# EAGLE design FloatWatch-One (EAGLE 7.7.0)
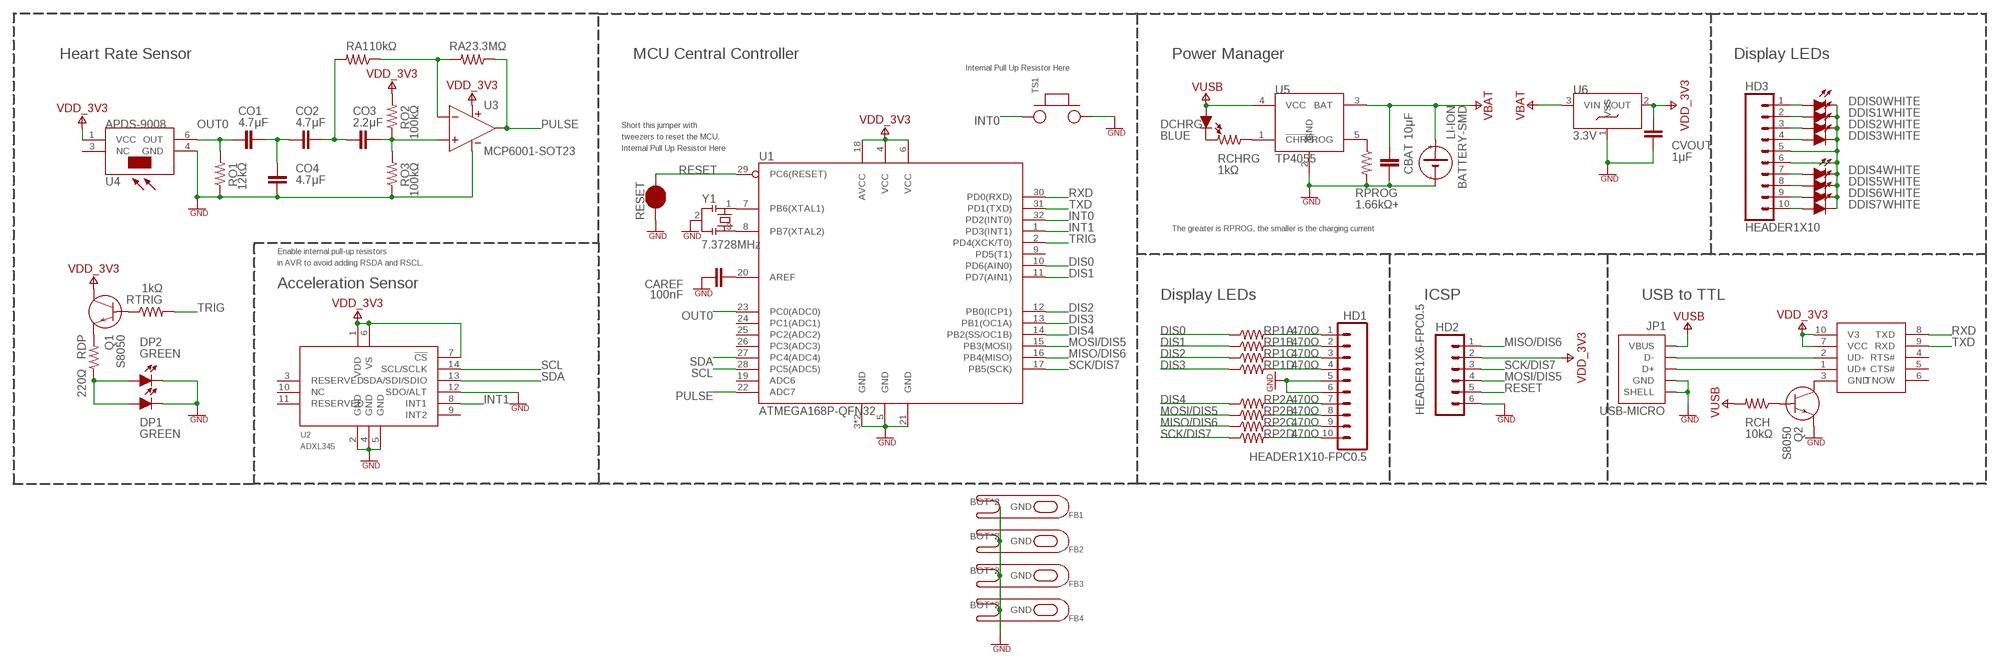
[diagram p0: schematic, sheet 1]

## Parts
CAREF  100nF  CAP-0603  [SMD0603]
CBAT  10μF  CAP-0603  [SMD0603]
CO1  4.7μF  CAP-0603  [SMD0603]
CO2  4.7μF  CAP-0603  [SMD0603]
CO3  2.2μF  CAP-0603  [SMD0603]
CO4  4.7μF  CAP-0603  [SMD0603]
CVOUT  1μF  CAP-0603  [SMD0603]
DCHRG  BLUE  LED-0603  [LED-0603]
DDIS0  WHITE  LED-0603  [LED-0603]
DDIS1  WHITE  LED-0603  [LED-0603]
DDIS2  WHITE  LED-0603  [LED-0603]
DDIS3  WHITE  LED-0603  [LED-0603]
DDIS4  WHITE  LED-0603  [LED-0603]
DDIS5  WHITE  LED-0603  [LED-0603]
DDIS6  WHITE  LED-0603  [LED-0603]
DDIS7  WHITE  LED-0603  [LED-0603]
DP1  GREEN  LED-1206  [LED-1206]
DP2  GREEN  LED-1206  [LED-1206]
FB1  BROAD-STICK  [BOARD-STICK]
FB2  BROAD-STICK  [BOARD-STICK]
FB3  BROAD-STICK  [BOARD-STICK]
FB4  BROAD-STICK  [BOARD-STICK]
HD1  HEADER1X10-FPC0.5  [FPC0.5-10]
HD2  HEADER1X6-FPC0.5  [FPC0.5-6]
HD3  HEADER1X10  [FPC0.5-10-SOLDER]
JP1  USB-MICRO  [USB-MICRO]
LI-ION  BATTERY-SMD  [BAT-SMD]
Q1  S8050  NPN-0  [SOT23-0]
Q2  S8050  NPN-0  [SOT23-0]
RA1  10kΩ  RES-0603  [SMD0603]
RA2  3.3MΩ  RES-0603  [SMD0603]
RCH  10kΩ  RES-0603  [SMD0603]
RCHRG  1kΩ  RES-0603  [SMD0603]
RDP  220Ω  RES-0603  [SMD0603]
RESET  JUMPER-SMD  [JMPER-SMD]
RO1  12kΩ  RES-0603  [SMD0603]
RO2  100kΩ  RES-0603  [SMD0603]
RO3  100kΩ  RES-0603  [SMD0603]
RP1  470Ω  RP-0603  [RP0603]
RP2  470Ω  RP-0603  [RP0603]
RPROG  1.66kΩ+  RES-0603  [SMD0603]
RTRIG  1kΩ  RES-0603  [SMD0603]
TS1  TS-P  [TS-3X4P]
U1  ATMEGA168P-QFN32  [QFN32]
U2  ADXL345  [LGA14]
U3  MCP6001-SOT23  [SOT23-5]
U4  APDS-9008  [APDS-9008]
U5  TP4055  [SOT23-5]
U6  3.3V  XC6206-0  [SOT23-0]
U7  CH340E  [MSOP10]
Y1  7.3728MHz  CSTCE  [CSTCE]

## Nets
!CHRG: RCHRG.1 U5.1(!CHRG)
!GND: DDIS0.C DDIS1.C DDIS2.C DDIS3.C DDIS4.C DDIS5.C DDIS6.C DDIS7.C HD3.5 HD3.6
AREF: CAREF.2 U1.20(AREF)
DIS0: RP1.1 U1.10(PD6(AIN0))
DIS1: RP1.3 U1.11(PD7(AIN1))
DIS2: RP1.5 U1.12(PB0(ICP1))
DIS3: RP1.7 U1.13(PB1(OC1A))
DIS4: RP2.1 U1.14(PB2(SS/OC1B))
DRCHRG: DCHRG.C RCHRG.2
GND: CAREF.1 CBAT.2 CO4.2 CVOUT.2 DP1.C DP2.C FB1.BOT(GND) FB1.TOP(GND) FB2.BOT(GND) FB2.TOP(GND) FB3.BOT(GND) FB3.TOP(GND) FB4.BOT(GND) FB4.TOP(GND) HD1.5 HD1.6 HD2.6 JP1.5(GND) JP1.P1(SHELL) JP1.P2(SHELL) JP1.P3(SHELL) JP1.P4(SHELL) LI-ION.- Q2.2(E) RESET.1 RO1.1 RO3.1 RPROG.2 TS1.2 U1.3(GND) U1.5(GND) U1.21(GND) U1.EP(GND) U2.2(GND) U2.4(GND) U2.5(GND) U2.12(SDO/ALT) U3.2(VSS) U4.4(GND) U5.2(GND) U6.1(VSS) Y1.2
GND(CH340E): Q2.3(C) U7.3(GND)
HD0: DDIS0.A HD3.1
HD1: DDIS1.A HD3.2
HD2: DDIS2.A HD3.3
HD3: DDIS3.A HD3.4
HD4: DDIS4.A HD3.7
HD5: DDIS5.A HD3.8
HD6: DDIS6.A HD3.9
HD7: DDIS7.A HD3.10
INT0: TS1.1 U1.32(PD2(INT0))
INT1: U1.1(PD3(INT1)) U2.8(INT1)
MISO/DIS6: HD2.1 RP2.5 U1.16(PB4(MISO))
MOSI/DIS5: HD2.4 RP2.3 U1.15(PB3(MOSI))
N-IN: RA1.1 RA2.2 U3.4(IN-)
OUT0: CO1.2 RO1.2 U1.23(PC0(ADC0)) U4.6(OUT)
OUT1: CO1.1 CO2.2 CO4.1
OUT2: CO2.1 CO3.2 RA1.2
P-IN: CO3.1 RO2.1 RO3.2 U3.3(IN+)
PROG: RPROG.1 U5.5(PROG)
PULSE: RA2.1 U1.22(ADC7) U3.1(OUT)
QRP: Q1.2(E) RDP.2
RDP: DP1.A DP2.A RDP.1
RESET: HD2.5 RESET.2 U1.29(PC6(RESET))
RH0: HD1.1 RP1.2
RH1: HD1.2 RP1.4
RH2: HD1.3 RP1.6
RH3: HD1.4 RP1.8
RH4: HD1.7 RP2.2
RH5: HD1.8 RP2.4
RH6: HD1.9 RP2.6
RH7: HD1.10 RP2.8
RQTRIG: Q1.1(B) RTRIG.1
RXD: U1.30(PD0(RXD)) U7.8(TXD)
SCK/DIS7: HD2.3 RP2.7 U1.17(PB5(SCK))
SCL: U1.28(PC5(ADC5)) U2.14(SCL/SCLK)
SDA: U1.27(PC4(ADC4)) U2.13(SDA/SDI/SDIO)
TRIG: RTRIG.2 U1.2(PD4(XCK/T0))
TRIGND: Q2.1(B) RCH.1
TXD: U1.31(PD1(TXD)) U7.9(RXD)
UD+: JP1.3(D+) U7.1(UD+)
UD-: JP1.2(D-) U7.2(UD-)
VBAT: CBAT.1 LI-ION.+ U5.3(BAT) U6.3(VIN)
VDD_3V3: CVOUT.1 HD2.2 Q1.3(C) RO2.2 U1.4(VCC) U1.6(VCC) U1.18(AVCC) U2.1(VDD) U2.6(VS) U2.7(!CS) U3.5(VDD) U4.1(VCC) U6.2(VOUT) U7.7(VCC) U7.10(V3)
VUSB: DCHRG.A JP1.1(VBUS) RCH.2 U5.4(VCC)
X1: U1.7(PB6(XTAL1)) Y1.1
X2: U1.8(PB7(XTAL2)) Y1.3
Unconnected: U1.9(PD5(T1)) U1.19(ADC6) U1.24(PC1(ADC1)) U1.25(PC2(ADC2)) U1.26(PC3(ADC3)) U2.3(RESERVED) U2.9(INT2) U2.10(NC) U2.11(RESERVED) U4.3(NC) U7.4(RTS#) U7.5(CTS#) U7.6(TNOW)

## Notes on the sheet
- Heart Rate Sensor | MCU Central Controller | Power Manager | Display LEDs
- Internal Pull Up Resistor Here
- Short this jumper with
- tweezers to reset the MCU.
- Internal Pull Up Resistor Here
- The greater is RPROG, the smaller is the charging current
- Enable internal pull-up resistors
- in AVR to avoid adding RSDA and RSCL.
- Acceleration Sensor
- Display LEDs | ICSP | USB to TTL

## Library data of the parts
CAREF CBAT CO1-CO4 CVOUT = MyLibrary:CAP: Non-polarized capacitor
DCHRG DDIS0 DDIS1-DDIS7 DP1 DP2 = MyLibrary:LED: Light Emitting Diode
FB1-FB4 = MyLibrary:BROAD-STICK
HD1 HD3 = MyLibrary:HEADER1X10
HD2 = MyLibrary:HEADER1X6: 6-pin Header (1*6) 0.5mm Pitch Connectors For FPC/FFC
JP1 = MyLibrary:USB: Universal Serial Bus
LI-ION = MyLibrary:BATTERY: Battery port
Q1 Q2 = MyLibrary:NPN: NPN Transistor
RA1 RA2 RCH RCHRG RDP RO1-RO3 RPROG RTRIG = MyLibrary:RES: Resistor
RESET = MyLibrary:JUMPER: Break of circuit, use iron to connect up
RP1 RP2 = MyLibrary:RP: Resistor Packs
TS1 = MyLibrary:TS: Touch switch (Button)
U1 = MyLibrary:ATMEGA168P: Atmel 32-pin 8-bit AVR microcontroller
U2 = MyLibrary:ADXL345: SPI/I2C Digital Acceleration sensor
U3 = MyLibrary:MCP6001: Single operatinal amplifier
U4 = MyLibrary:APDS-9008: Ambient light sensor
U5 = MyLibrary:TP4055: Li-ion battery charge IC
U6 = MyLibrary:XC6206: Regulator IC
U7 = MyLibrary:CH340E: USB to TTL IC
Y1 = MyLibrary:CSTCE: SMD resonator from Murata (CSTCE16M0V53-S0)

## Board
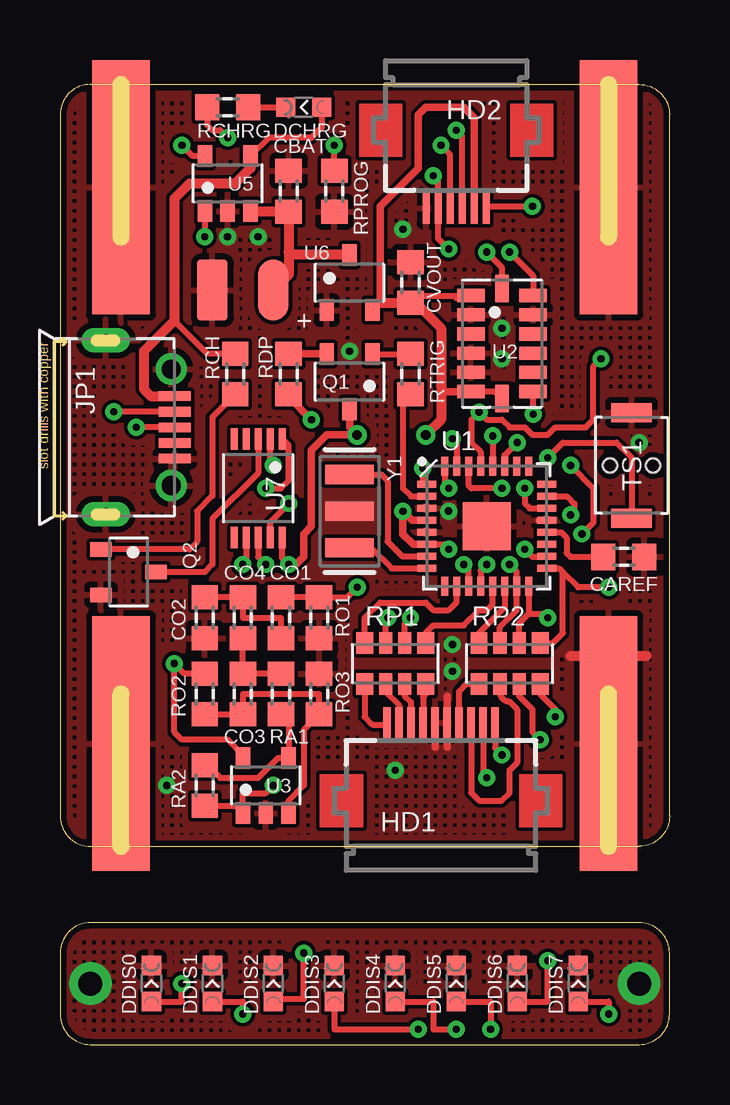
[diagram p1: board, top side]
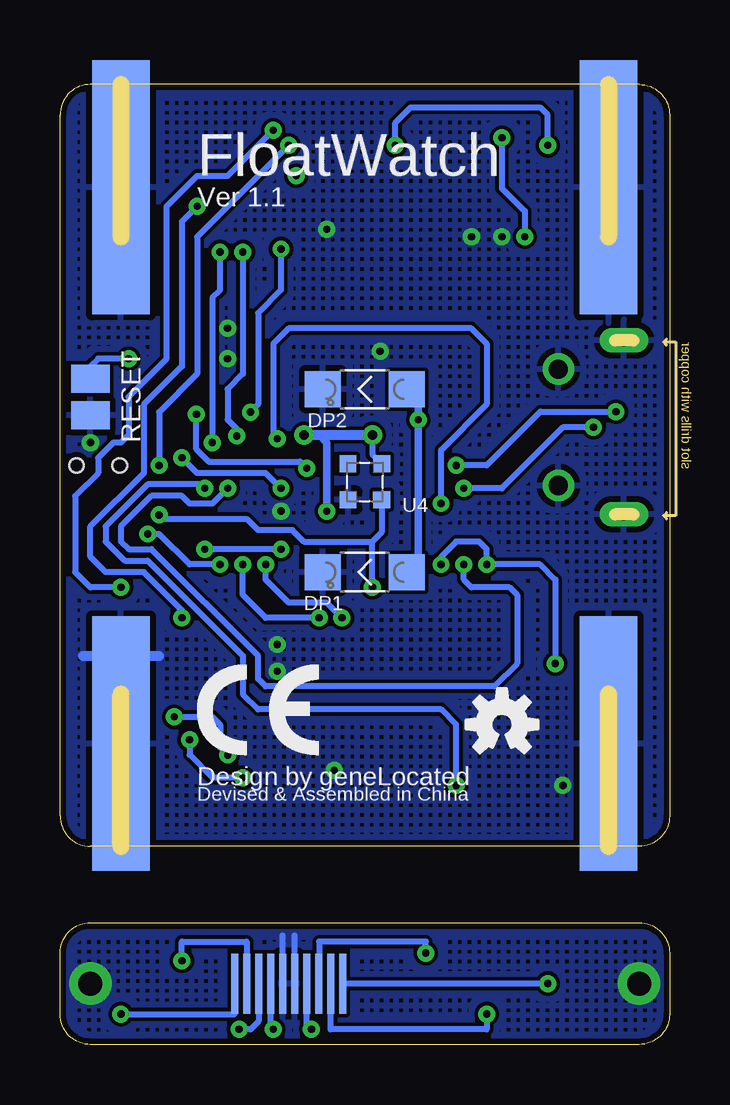
[diagram p2: board, bottom side, seen from below]

Size 25.4 x 40.01 mm. Coordinates in mm from the lower left corner, seen from the top.
Outline: 1.27,5.08 arc90 0,3.81 0,1.27 arc90 1.27,0 24.13,0 arc90 25.4,1.27 25.4,3.81 arc90 24.13,5.08 1.27,5.08
Outline: 25.4,9.53 25.4,38.73 arc90 24.13,40.01 1.27,40.01 arc90 0,38.73 0,9.53 arc90 1.27,8.26 24.13,8.26 arc90 25.4,9.53
Copper layers (1*16): Top 0.035mm / dielectric 1.5mm / Bottom 0.035mm
Design rules "default *": minimum track width 6mil, minimum drill 0.3mm, track to track 6mil, track to pad 6mil, pad to pad 6mil, via to via 6mil, smd to smd 6mil, copper to edge 10mil, drill to drill 8mil, minimum pad ring 10mil, minimum via ring 8mil, stop-mask expansion 4mil, vias tented up to drill 20mil, thermal gap 10mil

### Footprints (pad centres in the part's own frame; a part is rotated, then mirrored left to right if it is on the bottom)
SMD0603 = smd 1 x 1.1: 1 -0.85,0; 2 0.85,0
LED-0603 = smd 0.8 x 0.8: A 0,-0.75; C 0,0.75
LED-1206 = smd 1.5 x 1.5: A 0,-1.75; C 0,1.75
BOARD-STICK = smd 2.4 x 10.6 bottom: BOT 0,4.282 | smd 2.4 x 10.6: TOP 0,4.282
FPC0.5-10 = smd 0.3 x 1.3: 1 -2.25,3.25; 2 -1.75,3.25; 3 -1.25,3.25; 4 -0.75,3.25; 5 -0.25,3.25; 6 0.25,3.25; 7 0.75,3.25; 8 1.25,3.25; 9 1.75,3.25; 10 2.25,3.25
FPC0.5-6 = smd 0.3 x 1.3: 1 -1.25,3.25; 2 -0.75,3.25; 3 -0.25,3.25; 4 0.25,3.25; 5 0.75,3.25; 6 1.25,3.25
FPC0.5-10-SOLDER = smd 0.29 x 2.5: 1 -2.25,0; 2 -1.75,0; 3 -1.25,0; 4 -0.75,0; 5 -0.25,0; 6 0.25,0; 7 0.75,0; 8 1.25,0; 9 1.75,0; 10 2.25,0
USB-MICRO = smd 0.4 x 1.35: 1 -1.3,2.875; 2 -0.65,2.875; 3 0,2.875; 4 0.65,2.875; 5 1.3,2.875 | drill 0.508 pad 1.016 long: P1 -3.625,0; P2 3.625,0 | drill 0.8: P3 -2.425,2.73; P4 2.425,2.73
BAT-SMD = smd 1.27 x 2.54: + 1.27,0; - -1.27,0
SOT23-0 = smd 0.6 x 0.9: 1 -0.95,-1.15; 2 0.95,-1.15; 3 0,1.15
JMPER-SMD = smd 1.168 x 1.6: 1 -0.762,0; 2 0.762,0
RP0603 = smd 0.7 x 0.9: 1 -1.275,0.85; 2 -1.275,-0.85; 7 1.275,0.85; 8 1.275,-0.85 | smd 0.55 x 0.9: 3 -0.4,0.85; 4 -0.4,-0.85; 5 0.4,0.85; 6 0.4,-0.85
TS-3X4P = smd 0.8 x 1.7: 1 -2.2,0; 2 2.2,0 | hole 0.6: 0,0.9; 0,-0.9
QFN32 = smd 0.8 x 0.285: 1 -2.5,1.75; 2 -2.5,1.25; 3 -2.5,0.75; 4 -2.5,0.25; 5 -2.5,-0.25; 6 -2.5,-0.75; 7 -2.5,-1.25; 8 -2.5,-1.75; 17 2.5,-1.75; 18 2.5,-1.25; 19 2.5,-0.75; 20 2.5,-0.25; 21 2.5,0.25; 22 2.5,0.75; 23 2.5,1.25; 24 2.5,1.75 | smd 0.285 x 0.8: 9 -1.75,-2.5; 10 -1.25,-2.5; 11 -0.75,-2.5; 12 -0.25,-2.5; 13 0.25,-2.5; 14 0.75,-2.5; 15 1.25,-2.5; 16 1.75,-2.5; 25 1.75,2.5; 26 1.25,2.5; 27 0.75,2.5; 28 0.25,2.5; 29 -0.25,2.5; 30 -0.75,2.5; 31 -1.25,2.5; 32 -1.75,2.5 | smd 2 x 2: EP 0,0
LGA14 = smd 1.145 x 0.55: 1 -1.3,2; 2 -1.3,1.2; 3 -1.3,0.4; 4 -1.3,-0.4; 5 -1.3,-1.2; 6 -1.3,-2; 8 1.3,-2; 9 1.3,-1.2; 10 1.3,-0.4; 11 1.3,0.4; 12 1.3,1.2; 13 1.3,2 | smd 0.55 x 1.145: 7 0,-2.3; 14 0,2.3
SOT23-5 = smd 0.6 x 0.9: 1 -0.95,-1.15; 2 0,-1.15; 3 0.95,-1.15; 4 0.95,1.15; 5 -0.95,1.15
APDS-9008 = smd 0.7 x 0.7: 1 0.7,0.7; 3 -0.7,0.7; 4 -0.7,-0.8; 6 0.7,-0.8
MSOP10 = smd 0.9 x 0.3: 1 -2.055,1; 2 -2.055,0.5; 3 -2.055,0; 4 -2.055,-0.5; 5 -2.055,-1; 6 2.055,-1; 7 2.055,-0.5; 8 2.055,0; 9 2.055,0.5; 10 2.055,1
CSTCE = smd 0.8 x 2.032: 1 -1.524,0; 2 0,0; 3 1.524,0

### Placement (x,y rotation side)
CAREF  23.5,20.32 180 top
CBAT  9.53,35.56 90 top
CELOGO  [ICON-CE]  19.68,12.06 0 bottom
CO1  9.21,17.78 90 top
CO2  7.62,17.78 90 top
CO3  7.62,14.61 90 top
CO4  6.03,17.78 270 top
CVOUT  14.61,31.75 90 top
DCHRG  10.16,39.05 90 top
DDIS0  3.81,2.54 0 top
DDIS1  6.35,2.54 0 top
DDIS2  8.89,2.54 0 top
DDIS3  11.43,2.54 0 top
DDIS4  13.97,2.54 0 top
DDIS5  16.51,2.54 0 top
DDIS6  19.05,2.54 0 top
DDIS7  21.59,2.54 0 top
DP1  12.7,19.68 90 bottom
DP2  12.7,27.3 90 bottom
FB1  2.54,40.01 180 top
FB2  2.54,8.26 0 top
FB3  22.86,8.26 0 top
FB4  22.86,40.01 180 top
HD1  15.88,10.16 0 top
HD2  16.51,38.1 180 top
HD3  15.88,2.54 180 bottom
JP1  1.91,25.72 270 top
LI-ION  7.62,31.43 0 top
Q1  12.06,27.62 180 top
Q2  2.86,19.68 270 top
RA1  9.21,14.61 90 top
RA2  6.03,10.79 90 top
RCH  7.3,27.94 90 top
RCHRG  6.99,39.05 0 top
RDP  9.53,27.94 90 top
RESET  24.13,26.99 90 bottom
RO1  10.79,17.78 90 top
RO2  6.03,14.61 90 top
RO3  10.79,14.61 270 top
RP1  13.97,15.88 0 top
RP2  18.73,15.88 0 top
RPROG  11.43,35.56 270 top
RTRIG  14.61,27.94 270 top
TS1  23.81,24.13 90 top
U1  17.78,21.59 0 top
U2  18.41,29.21 0 top
U3  8.57,10.79 0 top
U4  12.7,23.5 0 bottom
U5  6.99,35.88 0 top
U6  12.06,31.75 0 top
U7  8.26,23.18 270 top
U$1  [ICON-OSHW]  6.99,13.34 0 bottom
Y1  12.06,22.23 270 top

### Tracks (layer width: path | path; a pad name or v marks a point on that pad's centre or on a via)
!CHRG  (via drill 0.3)
  Top 0.254: U5.1 v6.04,33.66 v6.03,33.66 | RCHRG.1 6.13,38.31 6.35,38.1 6.67,38.1 v6.99,37.78
  Bottom 0.254: v6.99,37.78 6.99,35.68 U5.1 v6.04,33.66 v6.03,33.66
!GND  (via drill 1 pad 1.78)
  Bottom 0.254: HD3.5 15.62,4.54 | HD3.6 16.12,4.54
  other vias: 1.27,2.54 24.13,2.54
  pour Top (hatched): 0,0 0,5.08 25.4,5.08 25.4,0
  pour Bottom (hatched): 0,5.08 0,0 25.4,0 25.4,5.08
AREF
  Top 0.254: U1.20 20.89,21.34 21.11,21.11 21.11,20.48 21.27,20.32 CAREF.2
DIS0
  Top 0.254: RP1.1 12.7,17.77 13.34,18.41 15.24,18.41 15.56,18.1 16.19,18.1 16.53,18.43 U1.10
DIS1  (via drill 0.3)
  Top 0.254: RP1.3 13.57,17.7 v13.65,17.78 | U1.11 17.03,19.8 v16.83,20
  Bottom 0.254: v13.65,17.78 14.29,18.41 15.88,18.41 16.83,19.37 v16.83,20
DIS2  (via drill 0.3)
  Top 0.254: RP1.5 14.37,17.55 v14.61,17.78 | v17.78,20 17.53,19.75 U1.12
  Bottom 0.254: v14.61,17.78 16.83,17.78 17.78,18.73 v17.78,20
DIS3
  Top 0.254: RP1.7 15.24,17.15 15.56,17.46 16.83,17.46 17.46,18.1 17.78,18.1 18.03,18.35 U1.13
DIS4
  Top 0.254: U1.14 18.53,18.21 17.46,17.14 RP2.1
DRCHRG
  Top 0.254: RCHRG.2 DCHRG.C
GND  (via drill 0.3)
  Top 0.254: U1.21 19.93,21.84
  Top 0.305: HD1.5 15.62,12.38 | HD1.6 16.12,12.38 | 16.12,14.52 16.12,13.49
  Top 0.406: 21.27,16.19 24.45,16.19
  Bottom 0.406: 24.45,16.19 21.27,16.19
  other vias: 13.97,11.43 6.99,33.66 8.26,33.66 18.41,28.57 16.19,22.23 14.29,33.97 16.35,16.67 24.13,25.08 16.35,15.56 12.06,28.89 18.41,29.84 4.45,10.79
  pour Top (hatched): 0,40.01 25.4,40.01 25.4,8.26 0,8.26
  pour Bottom (hatched): 0,40.01 25.4,40.01 25.4,8.26 0,8.26
  pour Top (no thermals): 10.79,24.77 10.79,19.68 13.34,19.68 13.34,24.77
GND(CH340E)
  Top 0.254: U7.3 8.26,23.81 6.35,21.91 6.35,20 6.03,19.68 Q2.3
HD0  (via drill 0.3)
  Top 0.254: DDIS0.A 5.08,1.79 v5.08,2.54
  Bottom 0.254: v5.08,2.54 HD3.1
HD1  (via drill 0.3)
  Top 0.254: DDIS1.A 7.62,1.79 v7.62,1.27
  Bottom 0.152: HD3.2
  Bottom 0.254: v7.62,1.27 7.62,0.64 14.13,0.64 HD3.2
HD2  (via drill 0.3)
  Top 0.152: DDIS2.A 8.89,1.91
  Top 0.254: 8.89,1.91 10.16,1.91 v10.16,3.81
  Bottom 0.152: 14.61,2.54 HD3.3
  Bottom 0.254: 14.61,2.56 HD3.3 | v10.16,3.81 10.16,4.29 14.61,4.29 14.61,2.54
HD3  (via drill 0.3)
  Top 0.254: v14.92,0.64 11.43,0.64 DDIS3.A
  Bottom 0.254: v14.92,0.64 15.12,0.64 HD3.4
HD4  (via drill 0.3)
  Top 0.254: DDIS4.A 15.56,1.79 15.56,0.64 v16.51,0.64
  Bottom 0.254: v16.51,0.64 16.62,0.64 HD3.7
HD5  (via drill 0.3)
  Top 0.254: DDIS5.A 17.94,1.79 v17.94,0.64
  Bottom 0.254: HD3.8 17.12,0.97 17.46,0.64 v17.94,0.64
HD6  (via drill 0.3)
  Top 0.254: DDIS6.A 20.32,1.79 v20.32,3.49
  Bottom 0.254: v20.32,3.49 20.32,4.29 17.62,4.29 HD3.9
HD7  (via drill 0.3)
  Top 0.254: DDIS7.A 22.86,1.79 v22.86,1.27
  Bottom 0.254: v22.86,1.27 18.12,1.27 HD3.10
INT0  (via drill 0.3)
  Top 0.254: U1.32 16.03,23.34 v16.19,23.18 | TS1.1 23.81,24.45 23.18,25.08 20.95,25.08 v20.32,24.45
  Bottom 0.254: v16.19,23.18 16.83,23.81 19.68,23.81 v20.32,24.45
INT1  (via drill 0.3)
  Top 0.254: v19.71,26.26 U2.8 | v15.12,24.01 15.12,23.5 U1.1
  Bottom 0.254: v19.71,26.26 19.71,24.8 19.21,24.29 15.4,24.29 v15.12,24.01
MISO/DIS6  (via drill 0.3)
  Top 0.254: U1.16 19.53,17.94 | 19.53,17.94 20.16,17.94 v20.32,17.78 | HD2.1 17.84,34.92 v19.68,34.92 | RP2.5 19.13,17.55 19.53,17.94
  Bottom 0.254: v19.68,34.92 20.32,34.29 20.32,28.26 21.91,26.67 21.91,23.81 24.13,21.59 24.13,20.32 23.5,19.68 21.91,19.68 20.32,18.1 v20.32,17.78
MOSI/DIS5  (via drill 0.3)
  Top 0.254: HD2.4 16.26,37.08 v15.88,37.47 | v18.73,20 19.03,19.7 U1.15 19.03,18.08 18.33,17.38 RP2.3 | v21.75,21.27 22.23,21.75 22.23,23.18 v21.27,24.13
  Bottom 0.254: v15.88,37.47 19.68,33.66 19.68,27.94 21.27,26.35 v21.27,24.13 | v18.73,20 20,20 21.27,21.27 v21.75,21.27
N-IN
  Top 0.254: RA1.1 9.52,13.76 U3.4 | RA2.2 6.03,11.43 6.35,11.43 6.67,11.11 8.26,11.11 9.09,11.95 U3.4 | 9.4,12.06 U3.4
OUT0  (via drill 0.3)
  Top 0.254: CO1.2 RO1.2 11.96,18.63 v12.38,19.05 | U1.23 21.13,22.84 21.43,22.54 21.43,22.23 v21.27,22.07
  Bottom 0.254: v12.38,19.05 12.38,20.95 | v21.27,22.07 21.11,21.91 17.62,21.91 17.14,21.43 15.72,21.43 15.24,20.95 12.38,20.95 | U4.6 12,21.34 12.38,20.95
OUT1
  Top 0.254: CO4.1 CO2.2 7.62,17.78 9.21,17.78 CO1.1
OUT2
  Top 0.254: CO2.1 CO3.2 RA1.2
P-IN
  Top 0.254: 7.72,13.76 CO3.1 | RO2.1 CO3.1 | CO3.1 7.62,14.61 10.79,14.61 RO3.2 10.16,13.12 10.16,10.79 9.52,10.16 U3.3
PROG  (via drill 0.3)
  Top 0.254: RPROG.1 v11.43,37.47 | v5.08,37.47 5.52,37.03 U5.5
  Bottom 0.254: v11.43,37.47 11.43,38.42 10.79,39.05 5.4,39.05 5.08,38.73 v5.08,37.47
PULSE  (via drill 0.3)
  Top 0.254: v8.89,10.79 8.57,10.48 7.62,10.48 U3.1 7.32,9.95 RA2.1 | v19.37,23.18 19.37,22.54 19.57,22.34 U1.22
  Bottom 0.254: v8.89,10.79 8.89,13.34 9.53,13.97 17.14,13.97 17.78,14.61 17.78,16.19 21.75,20.16 22.7,20.16 23.5,20.95 23.5,21.59 21.75,23.34 19.53,23.34 v19.37,23.18
QRP
  Top 0.305: RDP.2 11.1,28.79 Q1.2
RDP  (via drill 0.3)
  Top 0.305: v10.48,26.04 9.53,26.99 RDP.1
  Bottom 0.305: DP1.A 10.48,20.16 v10.48,26.04 10.48,26.83 DP2.A
RESET  (via drill 0.3)
  Top 0.254: v15.56,36.2 15.76,35.99 HD2.5 15.76,33.58 v16.19,33.15 | U1.29 17.53,24.7 17.14,25.08 17.14,26.04 v17.46,26.35 17.78,26.04 18.41,26.04 18.73,25.72 19.37,25.72 19.68,25.4 20.32,25.4 20.64,25.72 21.91,25.72 22.23,26.04 22.23,28.26 v22.54,28.57
  Bottom 0.254: v17.46,26.35 17.14,26.67 17.14,30.48 16.19,31.43 v16.19,33.15 | RESET.2 24.13,28.26 23.81,28.57 v22.54,28.57
RH0
  Top 0.254: RP1.2 12.7,13.66 13.02,13.34 13.55,13.34 HD1.1
RH1
  Top 0.254: RP1.4 13.57,14.69 14.12,14.13 HD1.2
RH2
  Top 0.254: HD1.3 14.62,14.27 14.37,14.52 RP1.6
RH3
  Top 0.254: RP1.8 15.24,14.61 15.12,14.49 HD1.4
RH4
  Top 0.254: HD1.7 16.62,14.72 16.93,15.03 RP2.2
RH5
  Top 0.254: RP2.4 18.33,14.69 arc90 18.73,14.29 19.05,13.97 19.05,11.75 18.73,11.43 18.73,10.48 18.41,10.16 17.46,10.16 17.12,10.5 HD1.8
RH6  (via drill 0.3)
  Top 0.254: HD1.9 17.62,11.27 v17.78,11.11 | RP2.6 19.13,14.52 19.68,13.97 19.68,13.02 v20,12.7
  Bottom 0.254: v17.78,11.11 19.05,11.11 20,12.06 v20,12.7
RH7  (via drill 0.3)
  Top 0.254: HD1.10 18.12,12.36 v18.41,12.06 | RP2.8 20.01,14.6 20.64,13.97 v20.64,13.65
  Bottom 0.254: v20.64,13.65 19.05,13.65 18.73,13.34 18.73,12.38 v18.41,12.06
RQTRIG
  Top 0.254: Q1.1 14.59,28.77 RTRIG.1
RXD  (via drill 0.3)
  Top 0.254: U7.8 8.26,20.32 v8.57,20 | U1.30 17.03,23.29 17.14,23.18 v18.41,23.18
  Bottom 0.254: v8.57,20 8.57,19.37 8.26,19.05 6.67,19.05 6.35,18.73 6.35,15.88 7.3,14.92 16.83,14.92 17.14,15.24 17.14,16.19 21.59,20.64 22.54,20.64 22.86,20.95 22.86,21.59 21.59,22.86 20.32,22.86 20,22.54 19.05,22.54 v18.41,23.18
SCK/DIS7  (via drill 0.3)
  Top 0.254: U1.17 20.8,19.84 20.95,19.68 | 20.95,19.68 21.59,19.05 v22.86,19.05 | RP2.7 20.54,16.73 20.95,17.14 20.95,19.68 | HD2.3 16.76,37.85 v16.51,38.1
  Bottom 0.254: v22.86,19.05 24.13,19.05 24.77,19.68 24.77,22.86 23.81,23.81 23.81,24.45 23.18,25.08 22.86,25.08 22.54,25.4 22.54,26.99 20.95,28.57 20.95,34.92 19.68,36.2 18.41,36.2 v16.51,38.1
SCL  (via drill 0.3)
  Top 0.254: v18.03,25.36 U1.28 | 18.41,31.75 U2.14 18.41,32.38 v17.78,33.02
  Bottom 0.254: v17.78,33.02 17.78,27.94 18.41,27.3 18.41,26.04 18.03,25.65 v18.03,25.36
SDA  (via drill 0.3)
  Top 0.254: 19.68,31.24 U2.13 19.71,32.04 v18.73,33.02 | v19.05,25.08 18.53,24.56 U1.27
  Bottom 0.254: v19.05,25.08 19.05,31.11 18.73,31.43 v18.73,33.02
TRIG
  Top 0.254: U1.2 14.62,22.84 14.29,23.18 14.29,26.77 RTRIG.2
TRIGND
  Top 0.254: RCH.1 6.35,26.14 6.35,22.86 5.71,22.23 5.71,20.95 5.39,20.64 Q2.1
TXD  (via drill 0.3)
  Top 0.254: 16.51,24.11 U1.31 16.53,25.06 v16.35,25.24 | v9.53,22.54 8.76,21.77 U7.9
  Bottom 0.254: v16.35,25.24 16.51,25.4 16.51,29.21 15.88,29.84 8.26,29.84 7.62,29.21 7.62,26.67 9.53,24.77 v9.53,22.54
UD+  (via drill 0.3)
  Top 0.254: v8.57,23.18 9.21,23.18 9.53,23.5 9.53,24.96 U7.1 | JP1.3 v3.17,25.72
  Bottom 0.254: v8.57,23.18 6.99,23.18 4.45,25.72 v3.17,25.72
UD-  (via drill 0.3)
  Top 0.254: v8.89,24.13 8.76,24.27 U7.2 | JP1.2 v2.24,26.37
  Bottom 0.254: v8.89,24.13 7.62,24.13 5.38,26.37 v2.24,26.37
VBAT
  Top 0.406: 9.53,33.02 CBAT.1 7.95,34.71 U5.3 | 9.53,33.02 9.53,32.07 LI-ION.+ | U6.3 9.64,32.9 9.53,33.02
VDD_3V3  (via drill 0.3, 0.4)
  Top 0.254: U2.7 18.11,27.21 U2.6 | U7.7 7.75,20.14 v7.62,20 | RO2.2 5.18,15.46 v4.76,15.88 4.76,13.02 5.08,12.7 6.99,12.7 7.62,12.06 U3.5 | 16.51,31.11 17.02,31.11 U2.1 14.91,31.21 CVOUT.1 | v9.53,20 9.26,20.27 U7.10 | U1.18 20.26,20.32 19.68,20.32 v19.37,20.64 | U1.6 15.99,20.84 v16.19,20.64
  Top 0.305: U6.2 13.34,30.97 13.34,34.92 14.92,36.51 14.92,38.73 15.24,39.05 16.83,39.05 17.26,38.62 HD2.2 | U1.4 14.67,21.84 v14.29,22.23 14.29,21.27 14.72,20.84 U1.6 | v9.53,20 9.84,20 10.16,20.32 10.16,21.27 10.48,21.59 10.48,24.77 11.11,25.4 v12.38,25.4 12.06,25.72 Q1.3 | U2.6 15.97,27.21 15.88,27.46
  Top 0.406: 14.36,30.65 CVOUT.1 | U6.2 13.27,30.9 CVOUT.1 | v15.24,25.4 15.88,26.04 15.88,27.46 15.88,29.84 14.82,30.9 CVOUT.1
  Bottom 0.254: v9.53,20 9.53,20.32 8.89,20.95 7.94,20.95 7.62,20.64 v7.62,20 5.4,20 4.76,19.37 v4.76,15.88 | v16.19,20.64 v19.37,20.64 | v12.38,25.4 12.38,24.58 U4.1
  Bottom 0.305: v14.29,22.23 14.29,25.08 14.61,25.4
  Bottom 0.406: v15.24,25.4 14.61,25.4 v12.38,25.4
VUSB
  Top 0.254: DCHRG.A 10.91,38.22 10.48,37.78 8.69,37.78 U5.4 | RCH.2 6.13,28.79 4.76,30.16
  Top 0.406: JP1.1 3.78,27.02 3.49,27.3 3.49,28.89 4.76,30.16 4.76,35.24 5.4,35.88 7.3,35.88 7.93,36.51 U5.4
X1
  Top 0.254: Y1.1 13.4,23.75 13.65,23.5 13.65,20.95 14.27,20.34 U1.7
X2
  Top 0.254: Y1.3 12.95,20.7 13.81,19.84 U1.8

### Text on the board
bPlace: FloatWatch | Ver 1.1 | Design by geneLocated | Devised & Assembled in China